# EAGLE design pi-camera-frame (EAGLE 9.4.0)
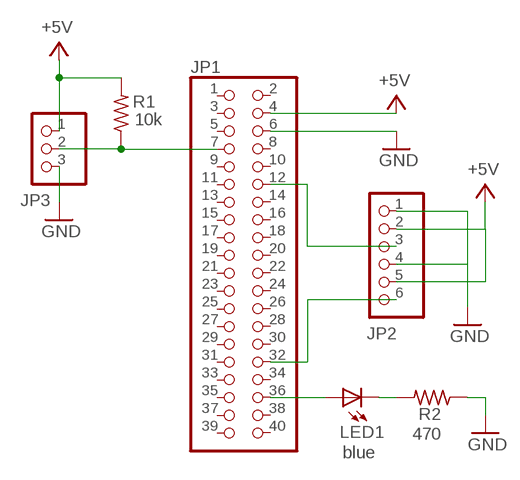
[diagram p0: schematic, sheet 1]

## Parts
JP1  PINHD-2X20  [2X20]
JP2  PINHD-1X6  [1X06]
JP3  PINHD-1X3  [1X03]
LED1  blue  LEDCHIP-LED0603  [CHIP-LED0603]
R1  10k  R-US_R0805  [R0805]
R2  470  R-US_R0805  [R0805]

## Nets
+5V: JP1.4 JP2.2 JP2.5 JP3.1 R1.2
GND: JP1.6 JP2.1 JP2.4 JP3.3 R2.1
N$1: JP1.12 JP2.3
N$2: JP1.7 JP3.2 R1.1
N$3: JP1.36 LED1.A
N$4: JP1.32 JP2.6
N$5: LED1.C R2.2
Unconnected: JP1.1 JP1.2 JP1.3 JP1.5 JP1.8 JP1.9 JP1.10 JP1.11 JP1.13 JP1.14 JP1.15 JP1.16 JP1.17 JP1.18 JP1.19 JP1.20 JP1.21 JP1.22 JP1.23 JP1.24 JP1.25 JP1.26 JP1.27 JP1.28 JP1.29 JP1.30 JP1.31 JP1.33 JP1.34 JP1.35 JP1.37 JP1.38 JP1.39 JP1.40

## Library data of the parts
JP1 = adafruit:PINHD-2X20: PIN HEADER
JP2 = adafruit:PINHD-1X6: PIN HEADER
JP3 = adafruit:PINHD-1X3: PIN HEADER
LED1 = adafruit:LED: LED OSRAM: - CHIPLED LG R971, LG N971, LY N971, LG Q971, LY Q971, LO R971, LY R971 LH N974, LH R974 LS Q976, LO Q976, LY Q976 LO Q996 - Hyper CHIPLED LW Q18S LB Q993, LB Q99A, LB R99A - SideLED LS A670, LO A670, LY A670, LG A670, LP A670 LB A673, LV A673, LT A673, LW A673 LH A674 LY A675 LS A676, LA A676, LO A676, LY A676, LW A676 LS A679, LY A679, LG A679 - Hyper Micro SIDELED® LS Y876, LA Y876, LO Y876, LY Y876 LT Y87S - SmartLED LW L88C, LW L88S LB L89C, LB L89S, LG L890 LS L89K, LO L89K, LY L89K LS L896, LA L896, LO L896, LY L896 - TOPLED LS T670, LO T670, LY T670, LG T670, LP T670 LSG T670, LSP T670, LSY T670, LOP T670, LYG T670 LG T671, LOG T671, LSG T671 LB T673, LV T673, LT T673, LW T673 LH T674 LS T676, LA T676, LO T676, LY T676, LB T676, LH T676, LSB T676, LW T676 LB T67C, LV T67C, LT T67C, LS T67K, LO T67K, LY T67K, LW E67C LS E67B, LA E67B, LO E67B, LY E67B, LB E67C, LV E67C, LT E67C LW T67C LS T679, LY T679, LG T679 LS T770, LO T770, LY T770, LG T770, LP T770 LB T773, LV T773, LT T773, LW T773 LH T774 LS E675, LA E675, LY E675, LS T675 LS T776, LA T776, LO T776, LY T776, LB T776 LHGB T686 LT T68C, LB T68C - Hyper Mini TOPLED® LB M676 - Mini TOPLED Santana® LG M470 LS M47K, LO M47K, LY M47K Source: http://www.osram.convergy.de/
R1 R2 = adafruit:R-US_: RESISTOR, American symbol

## Board
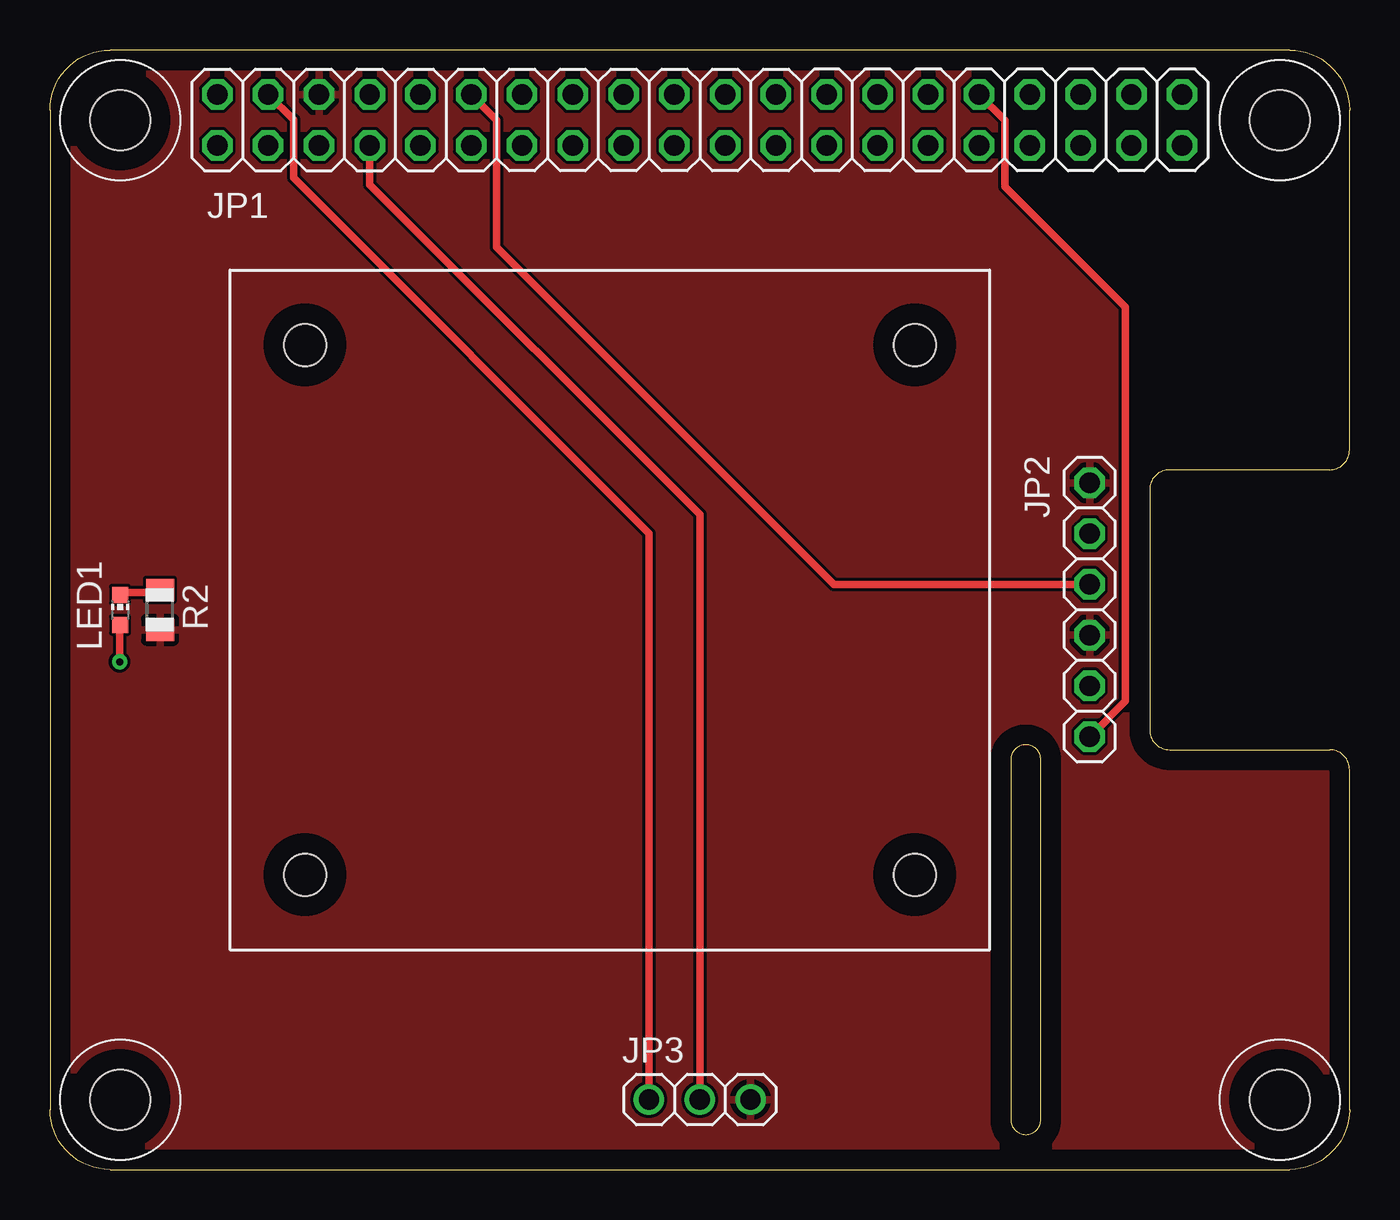
[diagram p1: board, top side]
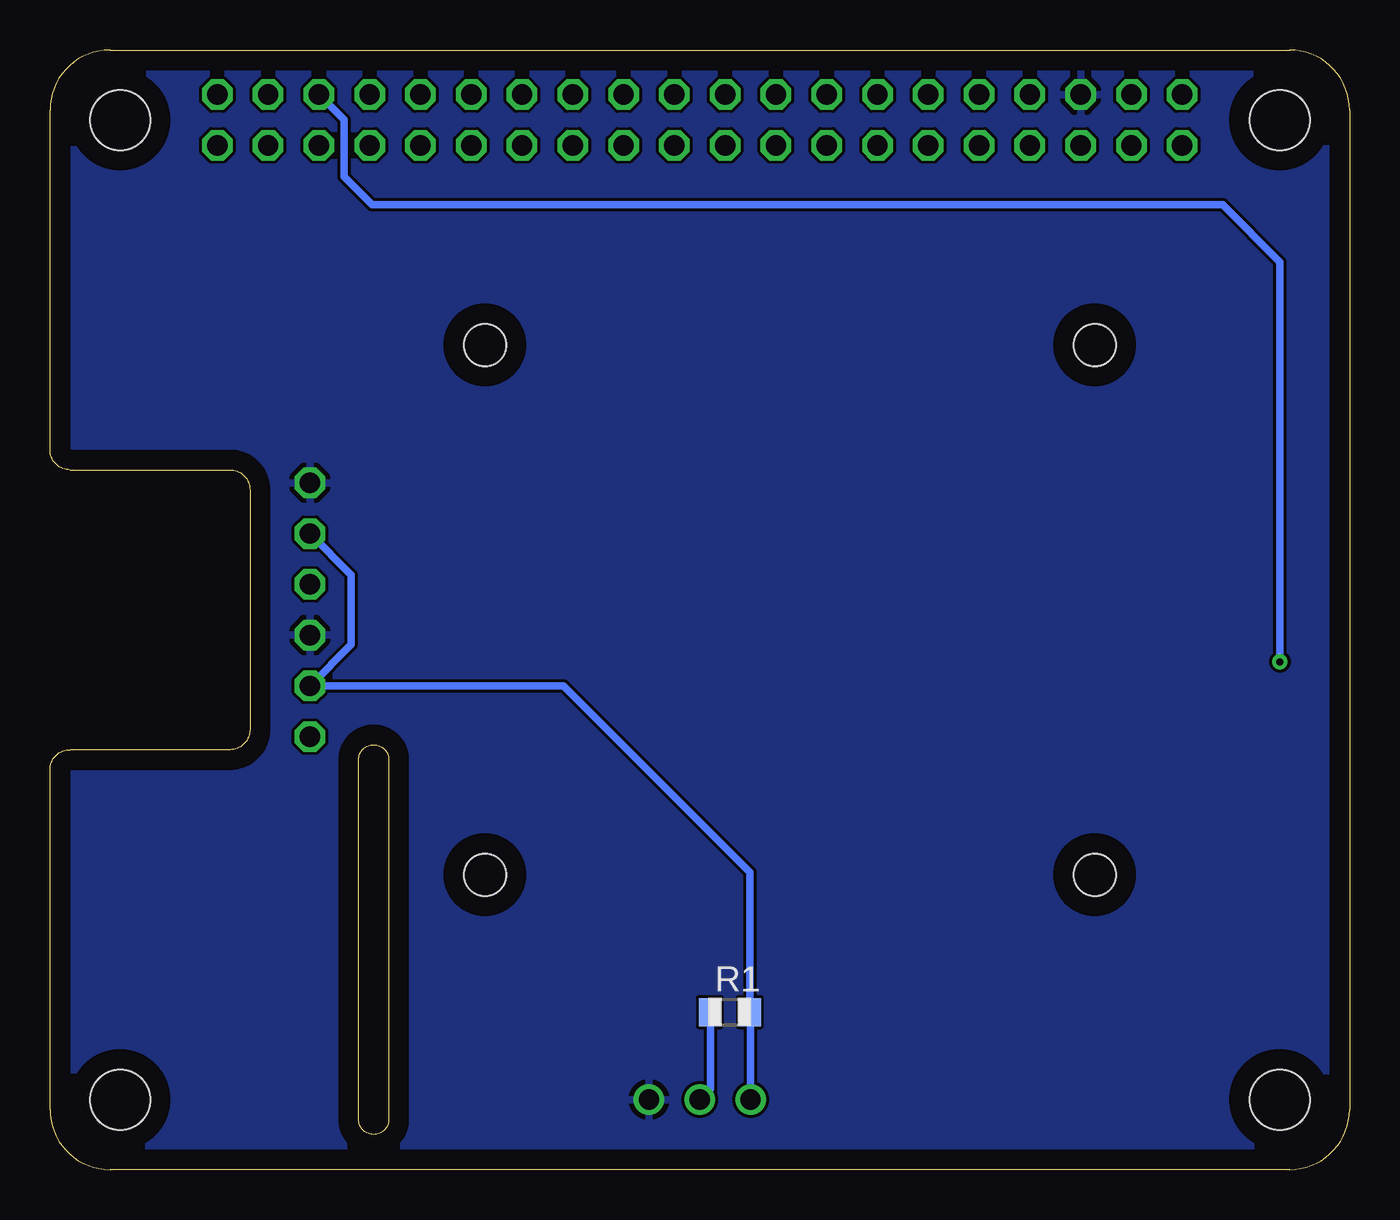
[diagram p2: board, bottom side, seen from below]

Size 65 x 56 mm. Coordinates in mm from the lower left corner, seen from the top.
Outline: 3,0 62,0 arc90 65,3 65,20 arc90 64,21 56,21 arc-90 55,22 55,34 arc-90 56,35 64,35 arc90 65,36 65,53 arc90 62,56 3,56 arc90 0,53 0,3 arc90 3,0
Outline: 48.06,20.5 48.06,2.5 arc180 49.56,2.5 49.56,20.5 arc180 48.06,20.5
Copper layers (1*16): Top 0.035mm / dielectric 1.5mm / Bottom 0.035mm
Design rules "default *": minimum track width 6mil, minimum drill 0.35mm, track to track 6mil, track to pad 6mil, pad to pad 6mil, via to via 6mil, smd to smd 6mil, copper to edge 40mil, drill to drill 6mil, minimum pad ring 10mil, minimum via ring 8mil, stop-mask expansion 4mil, vias tented up to drill 0mil, thermal gap 10mil
Holes 3 mm at 3.5,52.5 61.5,52.5 3.5,3.5 61.5,3.5
Holes 2.1 mm at 12.75,14.75 43.25,14.75 12.75,41.25 43.25,41.25

### Footprints (pad centres in the part's own frame; a part is rotated, then mirrored left to right if it is on the bottom)
2X20 = drill 1.016 octagon: 1 -24.13,-1.27; 2 -24.13,1.27; 3 -21.59,-1.27; 4 -21.59,1.27; 5 -19.05,-1.27; 6 -19.05,1.27; 7 -16.51,-1.27; 8 -16.51,1.27; 9 -13.97,-1.27; 10 -13.97,1.27; 11 -11.43,-1.27; 12 -11.43,1.27; 13 -8.89,-1.27; 14 -8.89,1.27; 15 -6.35,-1.27; 16 -6.35,1.27; 17 -3.81,-1.27; 18 -3.81,1.27; 19 -1.27,-1.27; 20 -1.27,1.27; 21 1.27,-1.27; 22 1.27,1.27; 23 3.81,-1.27; 24 3.81,1.27; 25 6.35,-1.27; 26 6.35,1.27; 27 8.89,-1.27; 28 8.89,1.27; 29 11.43,-1.27; 30 11.43,1.27; 31 13.97,-1.27; 32 13.97,1.27; 33 16.51,-1.27; 34 16.51,1.27; 35 19.05,-1.27; 36 19.05,1.27; 37 21.59,-1.27; 38 21.59,1.27; 39 24.13,-1.27; 40 24.13,1.27
1X06 = drill 1.016 octagon: 1 -6.35,0; 2 -3.81,0; 3 -1.27,0; 4 1.27,0; 5 3.81,0; 6 6.35,0
1X03 = drill 1.016: 1 -2.54,0; 2 0,0; 3 2.54,0
CHIP-LED0603 = smd 0.8 x 0.8: A 0,-0.75; C 0,0.75
R0805 = smd 1.1 x 1.4: 1 -1,0; 2 1,0

### Placement (x,y rotation side)
JP1  32.5,52.5 0 top
JP2  52,28 270 top
JP3  32.5,3.5 0 top
LED1  3.5,28 0 top
R1  30.99,7.87 0 bottom
R2  5.5,28 90 top

### Tracks (layer width: path | path; a pad name or v marks a point on that pad's centre or on a via)
+5V
  Top 0.381: JP1.4 12.18,52.5 12.18,49.6 29.97,31.81 JP3.1
  Bottom 0.381: JP2.2 49.94,29.75 49.94,26.25 JP2.5 39.32,24.19 29.99,14.86 R1.2 29.96,7.85 JP3.1
GND
  pour Top: 0,55.88 64.77,55.88 64.77,0 0,0
  pour Bottom: 0,55.88 64.77,55.88 64.77,0 0,0
N$1
  Top 0.381: JP1.12 22.34,52.5 22.34,46.15 39.22,29.27 JP2.3
N$2
  Top 0.381: JP3.2 32.5,32.76 15.99,49.27 JP1.7
  Bottom 0.381: R1.1 31.97,7.85 31.97,4.03 JP3.2
N$3  (via drill 0.35)
  Top 0.381: v3.48,25.4 3.48,27.23 LED1.A
  Bottom 0.381: JP1.36 50.29,52.51 50.29,49.66 48.9,48.26 6.35,48.26 3.48,45.39 v3.48,25.4
N$4
  Top 0.381: JP1.32 47.75,52.49 47.75,49.17 53.79,43.13 53.79,23.44 JP2.6
N$5
  Top 0.381: LED1.C 3.62,28.87 5.37,28.87 R2.2